# EAGLE schematic android_powerboard (EAGLE 5.07)
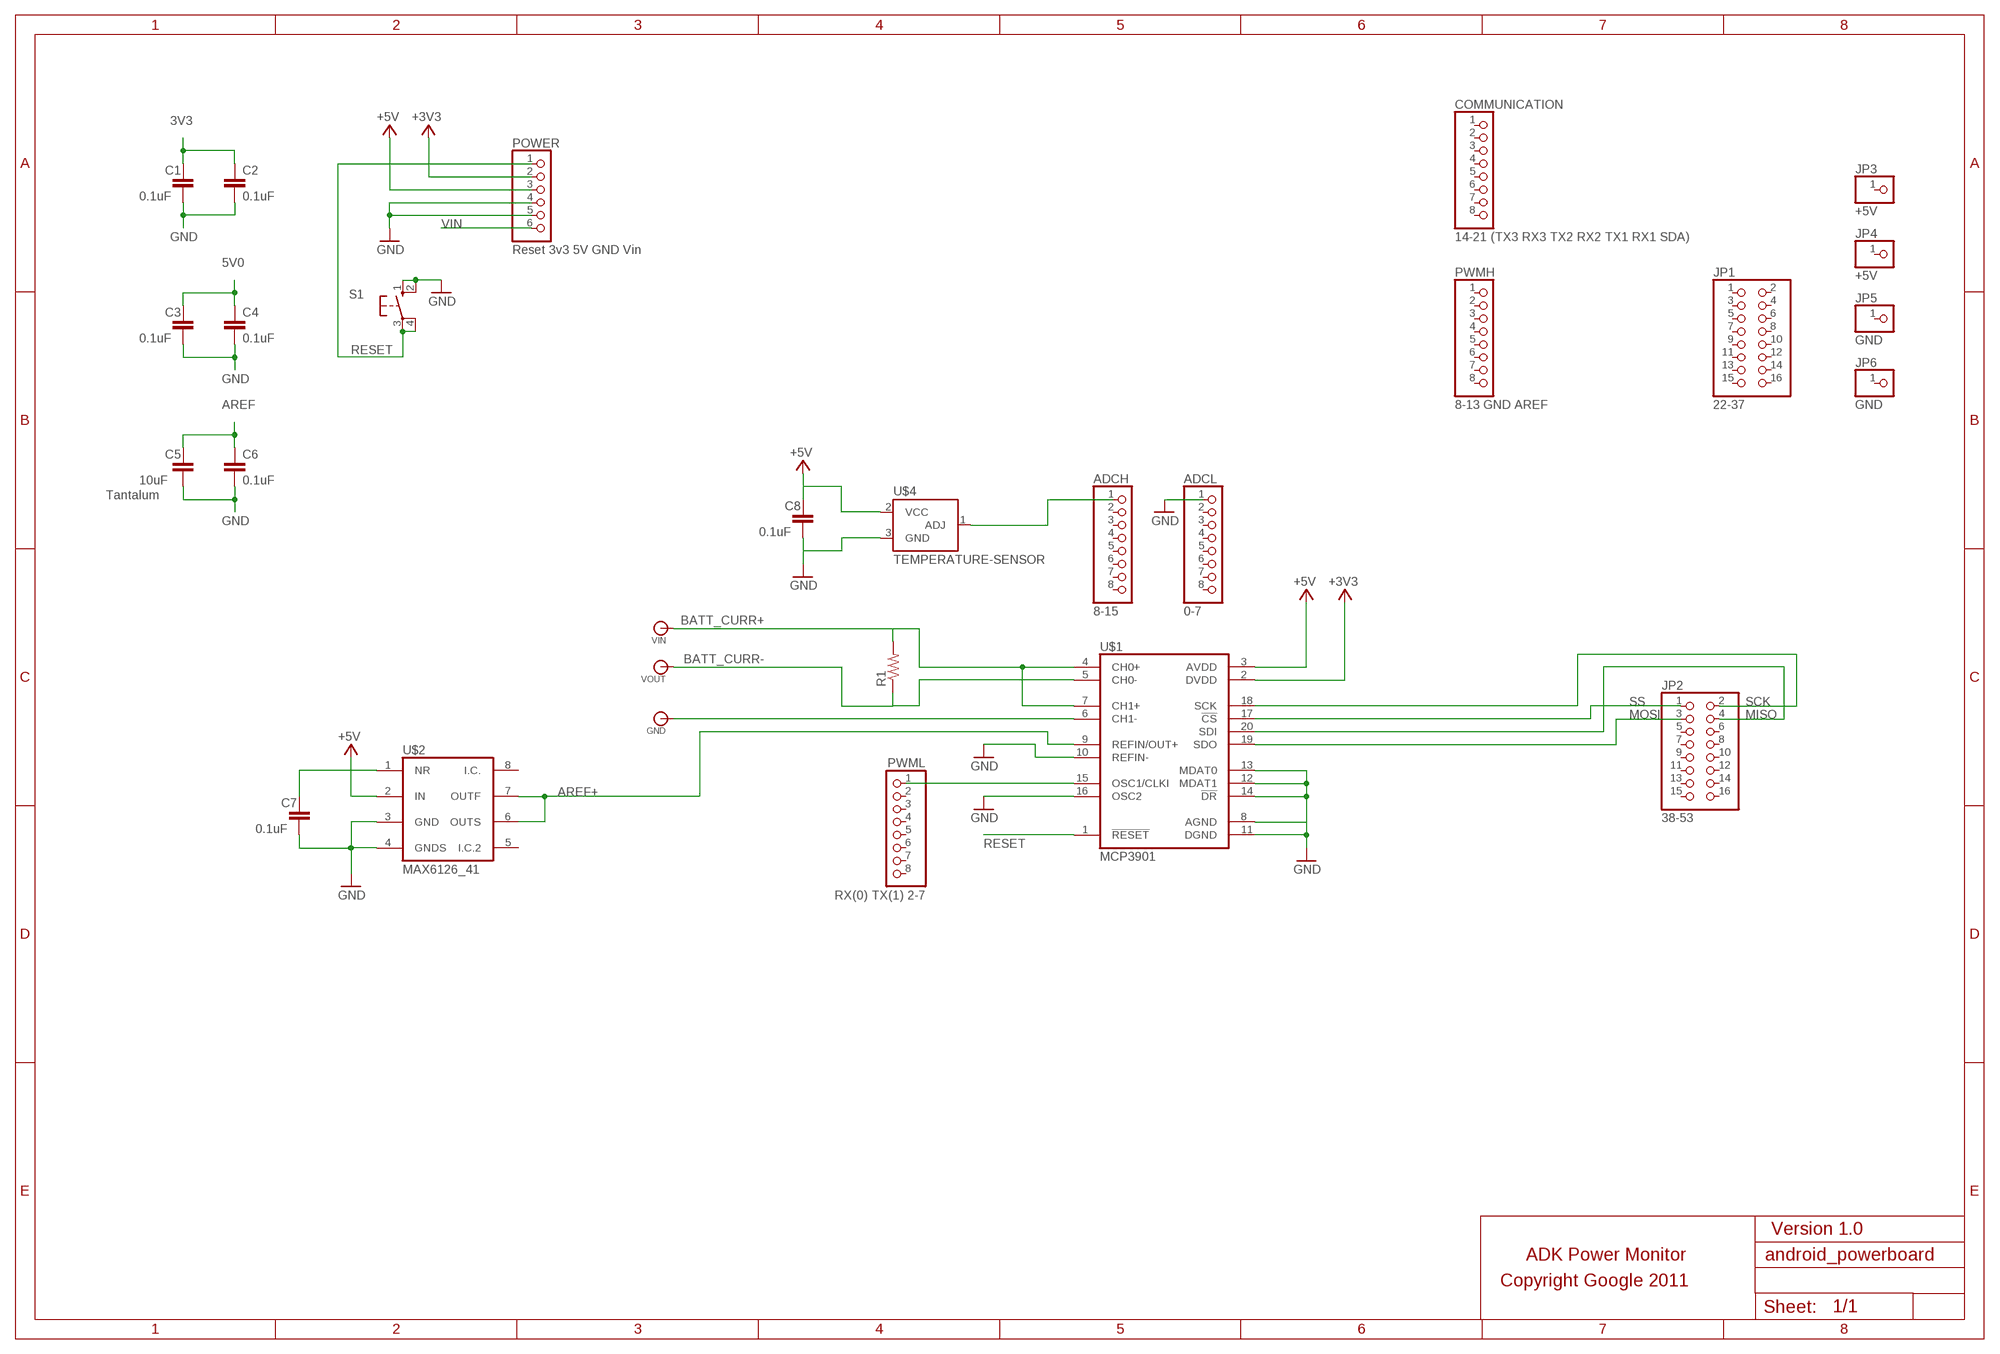
[diagram p0: schematic, sheet 1]

## Parts
ADCH  8-15  PINHD-1X8  [1X08]
ADCL  0-7  PINHD-1X8  [1X08]
C1  0.1uF  CAP0603-CAP  [0603-CAP]
C2  0.1uF  CAP0603-CAP  [0603-CAP]
C3  0.1uF  CAP0603-CAP  [0603-CAP]
C4  0.1uF  CAP0603-CAP  [0603-CAP]
C5  10uF  CAP0603-CAP  [0603-CAP]
C6  0.1uF  CAP0603-CAP  [0603-CAP]
C7  0.1uF  CAP0603-CAP  [0603-CAP]
C8  0.1uF  CAP0603-CAP  [0603-CAP]
COMMUNICATION  14-21 (TX3 RX3 TX2 RX2 TX1 RX1 SDA)  PINHD-1X8  [1X08]
GND  BANANA_CONN  [BANANA_CONN]
JP1  22-37  PINHD-2X8  [2X08]
JP2  38-53  PINHD-2X8  [2X08]
JP3  +5V  PINHD-1X1  [1X01]
JP4  +5V  PINHD-1X1  [1X01]
JP5  GND  PINHD-1X1  [1X01]
JP6  GND  PINHD-1X1  [1X01]
POWER  Reset 3v3 5V GND Vin  PINHD-1X6  [1X06]
PWMH  8-13 GND AREF  PINHD-1X8  [1X08]
PWML  RX(0) TX(1) 2-7  PINHD-1X8  [1X08]
R1  R-US_R2512  [R2512]
S1  10-XX  [B3F-10XX]
U$1  MCP3901  [SSOP20]
U$2  MAX6126_41  MAX6126  [SO08]
U$4  TEMPERATURE-SENSOR  [TO-92]
VIN  BANANA_CONN  [BANANA_CONN]
VOUT  BANANA_CONN  [BANANA_CONN]

## Nets
3V3: C1.1 C2.1
5V0: C3.1 C4.1
+3V3: POWER.2 U$1.2(DVDD)
+5V: C8.1 POWER.3 U$1.3(AVDD) U$2.2(IN) U$4.2(VCC)
AREF: C5.1 C6.1
AREF+: U$1.9(REFIN/OUT+) U$2.6(OUTS) U$2.7(OUTF)
BATT_CURR+: R1.2 U$1.4(CH0+) U$1.7(CH1+) VIN.P$1
BATT_CURR-: R1.1 U$1.5(CH0-) VOUT.P$1
GND: ADCL.1 C1.2 C2.2 C3.2 C4.2 C5.2 C6.2 C7.2 C8.2 POWER.4 POWER.5 S1.1(S) S1.2(S1) U$1.8(AGND) U$1.10(REFIN-) U$1.11(DGND) U$1.12(MDAT1) U$1.13(MDAT0) U$1.14(!DR) U$1.16(OSC2) U$2.3(GND) U$2.4(GNDS) U$4.3(GND)
MISO: JP2.4 U$1.20(SDI)
MOSI: JP2.3 U$1.19(SDO)
N$1: PWML.1 U$1.15(OSC1/CLKI)
N$2: GND.P$1 U$1.6(CH1-)
N$3: C7.1 U$2.1(NR)
N$4: ADCH.1 U$4.1(ADJ)
RESET: POWER.1 S1.3(P) S1.4(P1) U$1.1(!RESET)
SCK: JP2.2 U$1.18(SCK)
SS: JP2.1 U$1.17(!CS)
VIN: POWER.6
Unconnected: ADCH.2 ADCH.3 ADCH.4 ADCH.5 ADCH.6 ADCH.7 ADCH.8 ADCL.2 ADCL.3 ADCL.4 ADCL.5 ADCL.6 ADCL.7 ADCL.8 COMMUNICATION.1 COMMUNICATION.2 COMMUNICATION.3 COMMUNICATION.4 COMMUNICATION.5 COMMUNICATION.6 COMMUNICATION.7 COMMUNICATION.8 JP1.1 JP1.2 JP1.3 JP1.4 JP1.5 JP1.6 JP1.7 JP1.8 JP1.9 JP1.10 JP1.11 JP1.12 JP1.13 JP1.14 JP1.15 JP1.16 JP2.5 JP2.6 JP2.7 JP2.8 JP2.9 JP2.10 JP2.11 JP2.12 JP2.13 JP2.14 JP2.15 JP2.16 JP3.1 JP4.1 JP5.1 JP6.1 PWMH.1 PWMH.2 PWMH.3 PWMH.4 PWMH.5 PWMH.6 PWMH.7 PWMH.8 PWML.2 PWML.3 PWML.4 PWML.5 PWML.6 PWML.7 PWML.8 U$2.5(I.C.2) U$2.8(I.C.)

## Notes on the sheet
- Tantalum
- Version 1.0
- ADK Power Monitor
- Copyright Google 2011

## Library data of the parts
ADCH ADCL COMMUNICATION PWMH PWML = pinhead:PINHD-1X8: PIN HEADER
C1-C8 = SparkFun:CAP: Capacitor Standard 0603 ceramic capacitor, and 0.1" leaded capacitor.
GND VIN VOUT = SparkFun:BANANA_CONN
JP1 JP2 = pinhead:PINHD-2X8: PIN HEADER
JP3-JP6 = pinhead:PINHD-1X1: PIN HEADER
POWER = pinhead:PINHD-1X6: PIN HEADER
R1 = rcl:R-US_: RESISTOR, American symbol
S1 = switch-omron:10-XX: OMRON SWITCH
U$1 = microchip:MCP3901: MCP3901 Two-Channel Analog Front End
U$2 = maxim:MAX6126: Maxim MAX6126A-SOIC Ultra-High-Precision, Ultra-Low-Noise, Series Voltage Reference
U$4 = SparkFun:TEMPERATURE-SENSOR

## Net classes
0 default: width 0.203 mm, drill 0.406 mm, clearance 0.203 mm
1 power: width 0.61 mm, drill 0.711 mm, clearance 0.203 mm
2 gnd: width 0.305 mm, drill 0.711 mm, clearance 0.203 mm
3 usbvcc: width 0.508 mm, drill 0.711 mm, clearance 0.203 mm